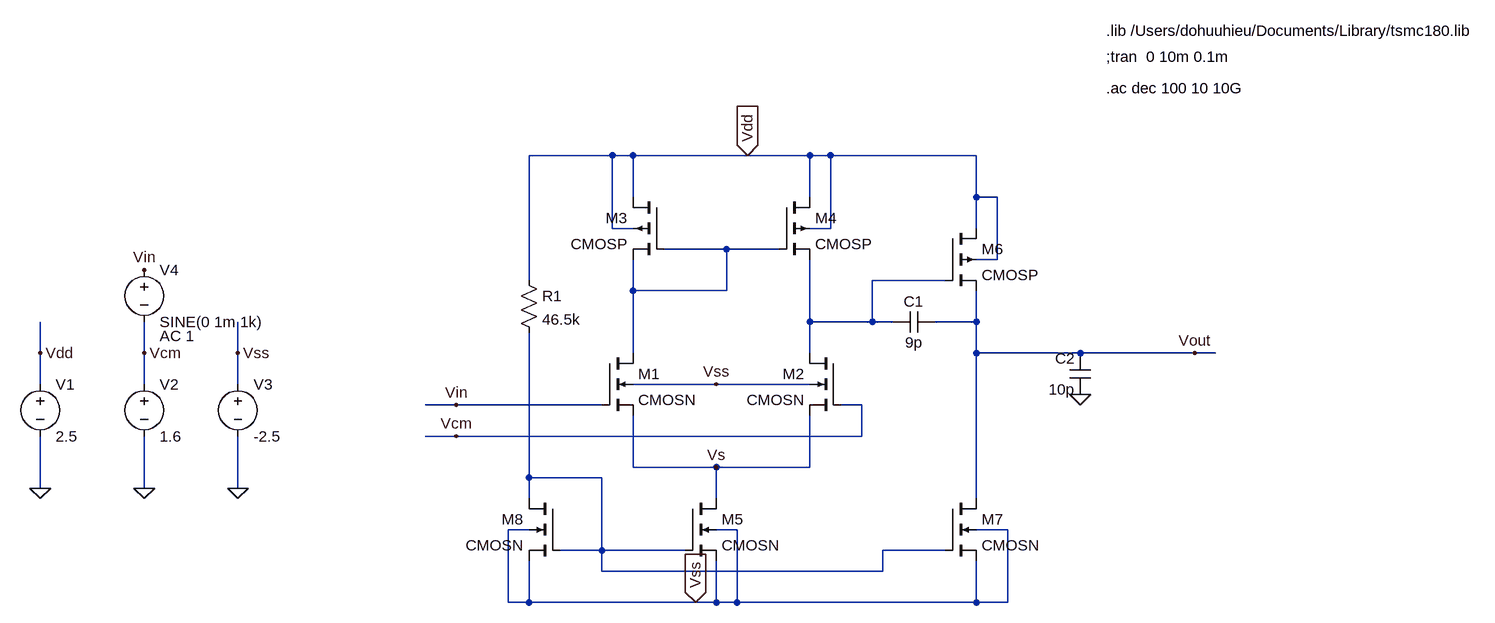
[diagram p0: schematic final _lab.asc]
final _lab.asc, the LTspice schematic file:
Version 4
SHEET 1 1348 680
WIRE 0 -192 -128 -192
WIRE 32 -192 0 -192
WIRE 208 -192 32 -192
WIRE 304 -192 208 -192
WIRE 336 -192 304 -192
WIRE 560 -192 336 -192
WIRE 32 -128 32 -192
WIRE 304 -128 304 -192
WIRE 560 -128 560 -192
WIRE 592 -128 560 -128
WIRE 0 -80 0 -192
WIRE 32 -80 0 -80
WIRE 336 -80 336 -192
WIRE 336 -80 304 -80
WIRE 560 -80 560 -128
WIRE 176 -48 80 -48
WIRE 256 -48 176 -48
WIRE 592 -32 592 -128
WIRE 592 -32 560 -32
WIRE -128 0 -128 -192
WIRE 512 0 400 0
WIRE 32 16 32 -32
WIRE 176 16 176 -48
WIRE 176 16 32 16
WIRE 304 64 304 -32
WIRE 400 64 400 0
WIRE 400 64 304 64
WIRE 432 64 400 64
WIRE 560 64 560 16
WIRE 560 64 496 64
WIRE -880 112 -880 64
WIRE -720 112 -720 64
WIRE -576 112 -576 64
WIRE 32 112 32 16
WIRE 304 112 304 64
WIRE 560 112 560 64
WIRE 720 112 560 112
WIRE 896 112 720 112
WIRE 928 112 896 112
WIRE -880 160 -880 112
WIRE -720 160 -720 112
WIRE -576 160 -576 112
WIRE 160 160 32 160
WIRE 304 160 160 160
WIRE -240 192 -288 192
WIRE -16 192 -240 192
WIRE 384 192 352 192
WIRE -240 240 -288 240
WIRE 384 240 384 192
WIRE 384 240 -240 240
WIRE 32 288 32 208
WIRE 160 288 32 288
WIRE 304 288 304 208
WIRE 304 288 160 288
WIRE -128 304 -128 80
WIRE -16 304 -128 304
WIRE -880 320 -880 240
WIRE -720 320 -720 240
WIRE -576 320 -576 240
WIRE -128 336 -128 304
WIRE 160 336 160 288
WIRE 560 336 560 112
WIRE -128 384 -160 384
WIRE 192 384 160 384
WIRE 608 384 560 384
WIRE -16 416 -16 304
WIRE -16 416 -80 416
WIRE 112 416 -16 416
WIRE 512 416 416 416
WIRE -16 448 -16 416
WIRE 416 448 416 416
WIRE 416 448 -16 448
WIRE -160 496 -160 384
WIRE -128 496 -128 432
WIRE -128 496 -160 496
WIRE 128 496 -128 496
WIRE 160 496 160 432
WIRE 160 496 128 496
WIRE 192 496 192 384
WIRE 192 496 160 496
WIRE 560 496 560 432
WIRE 560 496 192 496
WIRE 608 496 608 384
WIRE 608 496 560 496
FLAG -240 192 Vin
FLAG -240 240 Vcm
FLAG 720 176 0
FLAG 208 -192 Vdd
IOPIN 208 -192 In
FLAG 128 496 Vss
IOPIN 128 496 In
FLAG 160 288 Vs
FLAG 896 112 Vout
FLAG -880 320 0
FLAG -720 320 0
FLAG -576 320 0
FLAG -880 112 Vdd
FLAG -576 112 Vss
FLAG -720 112 Vcm
FLAG -720 -16 Vin
FLAG 160 160 Vss
SYMBOL cmosn -16 112 R0
SYMATTR InstName M1
SYMATTR Value2 l=180n w=540n
SYMBOL cmosn 352 112 M0
SYMATTR InstName M2
SYMATTR Value2 l=180n w=540n
SYMBOL cmosn -80 336 M0
SYMATTR InstName M8
SYMATTR Value2 l=180n w=810n
SYMBOL cmosn 112 336 R0
SYMATTR InstName M5
SYMATTR Value2 l=180n w=810n
SYMBOL cmosn 512 336 R0
SYMATTR InstName M7
SYMATTR Value2 l=180n w=1080n
SYMBOL cmosp 80 -128 M0
SYMATTR InstName M3
SYMATTR Value2 l=180n w=27000n
SYMBOL cmosp 256 -128 R0
SYMATTR InstName M4
SYMATTR Value2 l=180n w=2700n
SYMBOL cmosp 512 -80 R0
SYMATTR InstName M6
SYMATTR Value2 l=180n w=6840n
SYMBOL res -144 -16 R0
SYMATTR InstName R1
SYMATTR Value 46.5k
SYMBOL voltage -880 144 R0
WINDOW 123 0 0 Left 0
WINDOW 39 0 0 Left 0
SYMATTR InstName V1
SYMATTR Value 2.5
SYMBOL voltage -720 144 R0
WINDOW 123 0 0 Left 0
WINDOW 39 0 0 Left 0
SYMATTR InstName V2
SYMATTR Value 1.6
SYMBOL voltage -576 144 R0
WINDOW 123 0 0 Left 0
WINDOW 39 0 0 Left 0
SYMATTR InstName V3
SYMATTR Value -2.5
SYMBOL voltage -720 -32 R0
WINDOW 123 24 118 Left 2
WINDOW 39 0 0 Left 0
SYMATTR Value2 AC 1
SYMATTR InstName V4
SYMATTR Value SINE(0 1m 1k)
SYMBOL cap 496 48 R90
WINDOW 0 0 32 VBottom 2
WINDOW 3 32 32 VTop 2
SYMATTR InstName C1
SYMATTR Value 9p
SYMBOL cap 736 176 R180
WINDOW 0 24 56 Left 2
WINDOW 3 24 8 Left 2
SYMATTR InstName C2
SYMATTR Value 10p
TEXT 760 -344 Left 2 !;tran  0 10m 0.1m
TEXT 760 -296 Left 2 !.ac dec 100 10 10G
TEXT 760 -384 Left 2 !.lib /Users/dohuuhieu/Documents/Library/tsmc180.lib

The netlist it stands for:
* final _lab.asc
M1 N001 Vin Vs Vss CMOSN l=180n w=540n
M2 N002 Vcm Vs Vss CMOSN l=180n w=540n
M8 N003 N003 Vss Vss CMOSN l=180n w=810n
M5 Vs N003 Vss Vss CMOSN l=180n w=810n
M7 Vout N003 Vss Vss CMOSN l=180n w=1080n
M3 Vdd N001 N001 Vdd CMOSP l=180n w=27000n
M4 Vdd N001 N002 Vdd CMOSP l=180n w=2700n
M6 Vdd N002 Vout Vdd CMOSP l=180n w=6840n
R1 Vdd N003 46.5k
V1 Vdd 0 2.5
V2 Vcm 0 1.6
V3 Vss 0 -2.5
V4 Vin Vcm SINE(0 1m 1k) AC 1
C1 Vout N002 9p
C2 0 Vout 10p
.model NMOS NMOS
.model PMOS PMOS
.lib standard.mos
;tran  0 10m 0.1m
.ac dec 100 10 10G
.lib /Users/dohuuhieu/Documents/Library/tsmc180.lib
.backanno
.end